# Altium schematic sheet SK6812.SchDoc
size 76 x 50 mm
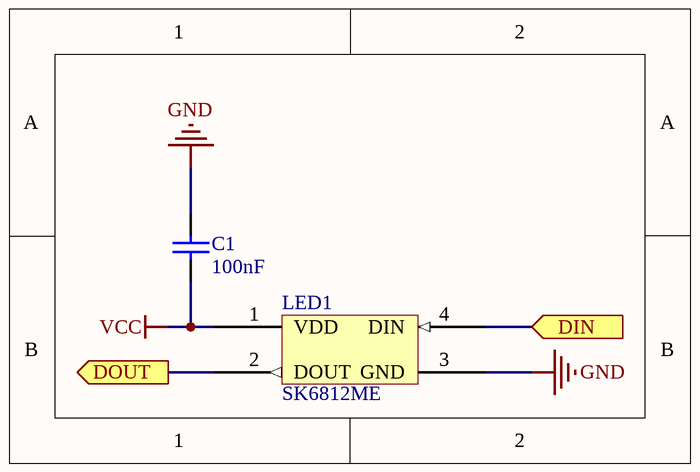
[diagram p0: SK6812.SchDoc]

## Parts
C1  100nF  [CAPC1005X55X30LL05T10]
LED1  SK6812ME  [SK6812ME]

## Ports
DIN (in), DOUT (out)

## Nets
GND: C1.2 LED1.3(GND)
VCC: C1.1 LED1.1(VDD)
DIN: LED1.4(DIN) ; port DIN
DOUT: LED1.2(DOUT) ; port DOUT

## Library data of the parts
C1 = CMP-0001-00074-2: Manufacturer: Kemet; Part Number: C0402C104K4RACTU
LED1 = SK6812: Individually Adressable SK6812 Mini-E 3528 LED